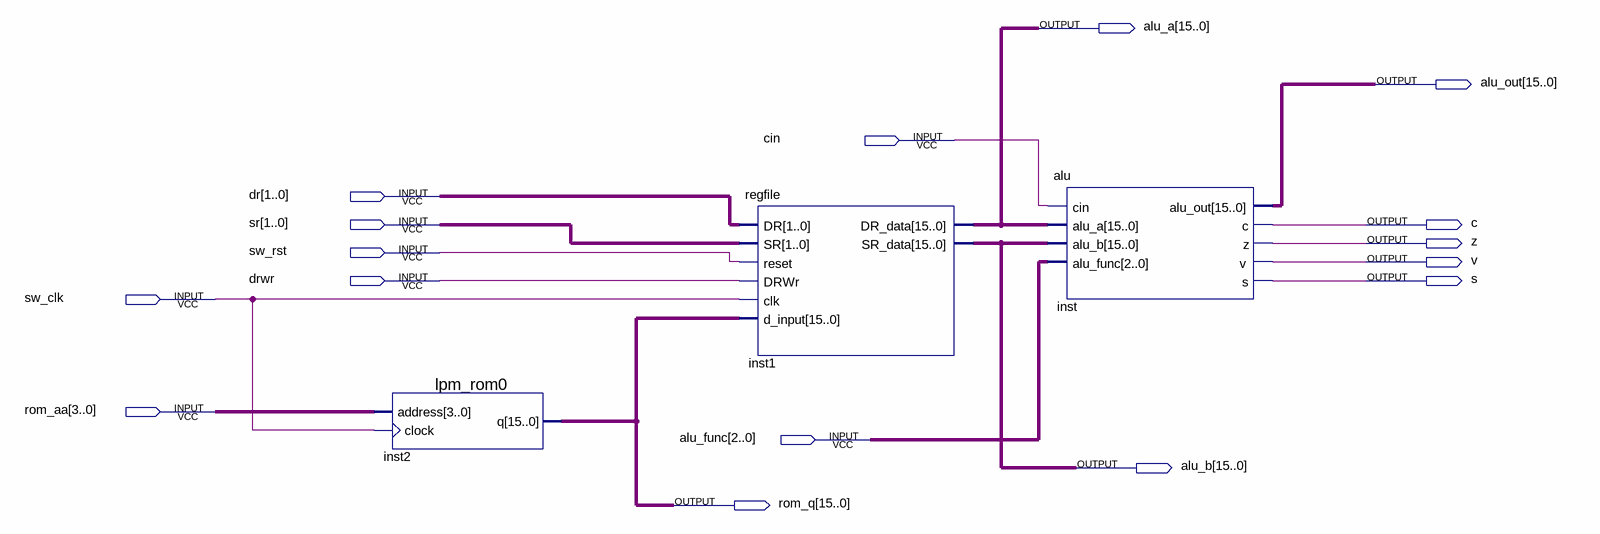
[diagram p0: schematic sheet]
// Quartus schematic ALU_EXP_II.bdf as structural Verilog: 3 symbols, 16 pins
module ALU_EXP_II (
  input  cin,
  input  [1:0] dr,
  input  [1:0] sr,
  input  sw_rst,
  input  drwr,
  input  sw_clk,
  input  [3:0] rom_aa,
  input  [2:0] alu_func,
  output [15:0] alu_a,
  output [15:0] alu_out,
  output c,
  output z,
  output v,
  output s,
  output [15:0] alu_b,
  output [15:0] rom_q
);

  lpm_rom0 inst2 (.address(rom_aa), .clock(sw_clk), .q(rom_q));
  regfile inst1 (
    .DR(dr), .SR(sr), .reset(sw_rst), .DRWr(drwr), .clk(sw_clk), .d_input(rom_q), .DR_data(alu_a),
    .SR_data(alu_b));
  alu inst (
    .cin(cin), .alu_a(alu_a), .alu_b(alu_b), .alu_func(alu_func), .alu_out(alu_out), .c(c), .z(z), .v(v),
    .s(s));
endmodule
